# EAGLE schematic Voltage Controlled Amplifier v1 (EAGLE 6.6.0)

## Sheet 1 of 2: Power
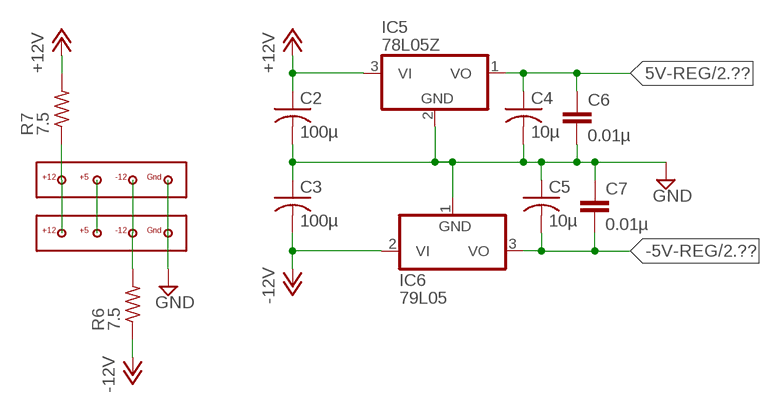
[diagram p0: schematic, sheet 1]

### Parts
C2  100µ  C-US025-050X050  [C025-050X050]
C3  100µ  C-US025-050X050  [C025-050X050]
C4  10µ  C-US025-050X050  [C025-050X050]
C5  10µ  C-US025-050X050  [C025-050X050]
C6  0.01µ  C2.5/2  [C2.5-2]
C7  0.01µ  C2.5/2  [C2.5-2]
IC5  78L05Z  [TO92]
IC6  79L05  79L05Z  [TO92]
R6  7.5  R-US_0204/7  [0204/7]
R7  7.5  R-US_0204/7  [0204/7]
U$3  POWER_CONNECTOR_4_RGBB  [POWER_CONNECTOR_4_RGBB]
U$7  POWER_CONNECTOR_4_RGBB  [POWER_CONNECTOR_4_RGBB]

### Nets
5V-REG: C4.1 C6.1 IC5.1(VO) ; also sheet 2
+12V: C2.1 IC5.3(VI) R7.2 ; also sheet 2
-5V-REG: C5.2 C7.2 IC6.3(VO) ; also sheet 2
-12V: C3.2 IC6.2(VI) R6.1 ; also sheet 2
GND: C2.2 C3.1 C4.2 C5.1 C6.2 C7.1 IC5.2(GND) IC6.1(GND) U$3.GND U$7.GND ; also sheet 2
N$10: R7.1 U$3.+12 U$7.+12
N$11: U$3.+5 U$7.+5
N$12: R6.2 U$3.-12 U$7.-12

## Sheet 2 of 2
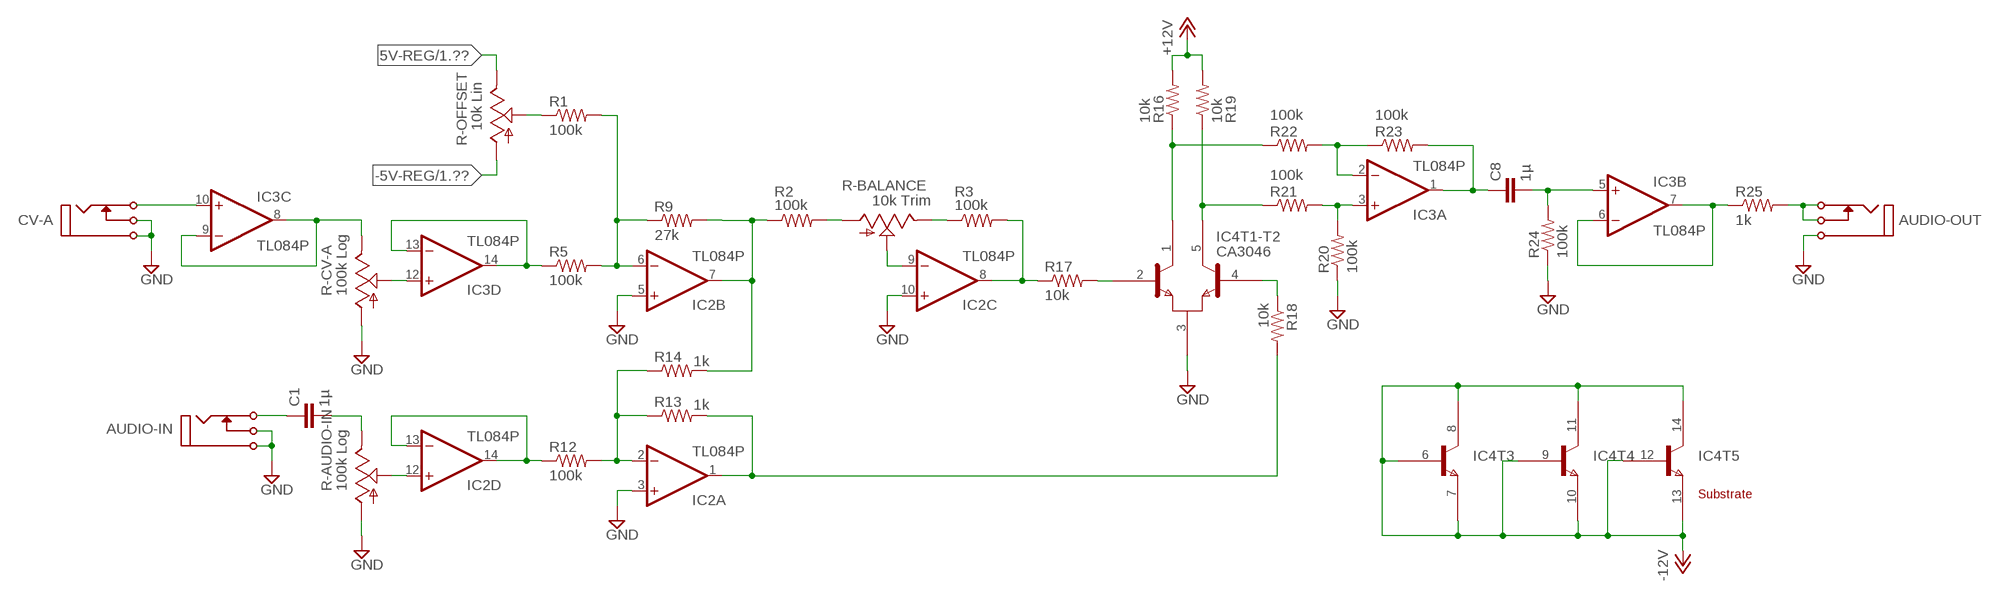
[diagram p1: schematic, sheet 2]

### Parts
AUDIO-IN  I/O  MONO_JACK  [MONO_JACK]
AUDIO-OUT  I/O  MONO_JACK  [MONO_JACK]
C1  1µ  C2.5/2  [C2.5-2]
C8  1µ  C2.5/2  [C2.5-2]
CV-A  I/O  MONO_JACK  [MONO_JACK]
IC2  TL084P  [DIL14]
IC3  TL084P  [DIL14]
IC4  CA3046  [DIL14]
R1  100k  R-US_0204/7  [0204/7]
R2  100k  R-US_0204/7  [0204/7]
R3  100k  R-US_0204/7  [0204/7]
R5  100k  R-US_0204/7  [0204/7]
R9  27k  R-US_0204/7  [0204/7]
R12  100k  R-US_0204/7  [0204/7]
R13  1k  R-US_0204/7  [0204/7]
R14  1k  R-US_0204/7  [0204/7]
R16  10k  R-US_0204/7  [0204/7]
R17  10k  R-US_0204/7  [0204/7]
R18  10k  R-US_0204/7  [0204/7]
R19  10k  R-US_0204/7  [0204/7]
R20  100k  R-US_0204/7  [0204/7]
R21  100k  R-US_0204/7  [0204/7]
R22  100k  R-US_0204/7  [0204/7]
R23  100k  R-US_0204/7  [0204/7]
R24  100k  R-US_0204/7  [0204/7]
R25  1k  R-US_0204/7  [0204/7]
R-AUDIO-IN  100k Log  TRIM_US-B64Y  [B64Y]
R-BALANCE  10k Trim  TRIM_US-B64Y  [B64Y]
R-CV-A  100k Log  TRIM_US-B64Y  [B64Y]
R-OFFSET  10k Lin  TRIM_US-B64Y  [B64Y]

### Nets
5V-REG: R-OFFSET.E ; also sheet 1
+12V: R16.2 R19.2 ; also sheet 1
-5V-REG: R-OFFSET.A ; also sheet 1
-12V: IC4.6(T3:B) IC4.7(T3:E) IC4.8(T3:C) IC4.9(T4:B) IC4.10(T4:E) IC4.11(T4:C) IC4.12(T5:B) IC4.13(T5:E) IC4.14(T5:C) ; also sheet 1
GND: AUDIO-IN.P$1 AUDIO-IN.P$3(P3) AUDIO-OUT.P$1 CV-A.P$1 CV-A.P$3(P3) IC2.3(A:+IN) IC2.5(B:+IN) IC2.10(C:+IN) IC4.3(T1-T2:E) R20.1 R24.1 R-AUDIO-IN.A R-CV-A.A ; also sheet 1
N$1: IC3.13(D:-IN) IC3.14(D:OUT) R5.1
N$2: IC4.2(T1-T2:B1) R17.2
N$3: CV-A.P$2(P2) IC3.10(C:+IN)
N$4: IC3.8(C:OUT) IC3.9(C:-IN) R-CV-A.E
N$5: R3.1 R-BALANCE.E
N$6: IC2.6(B:-IN) R1.2 R5.2 R9.1
N$7: R2.2 R-BALANCE.A
N$13: R1.1 R-OFFSET.S
N$14: IC3.12(D:+IN) R-CV-A.S
N$15: IC2.7(B:OUT) R2.1 R14.2
N$16: R9.2
N$17: AUDIO-IN.P$2(P2) C1.1
N$18: IC2.13(D:-IN) IC2.14(D:OUT) R12.1
N$19: IC2.12(D:+IN) R-AUDIO-IN.S
N$20: C1.2 R-AUDIO-IN.E
N$21: IC4.4(T1-T2:B2) R18.1
N$22: IC2.2(A:-IN) R12.2 R13.1 R14.1
N$23: IC2.8(C:OUT) R3.2 R17.1
N$24: IC4.1(T1-T2:C1) R16.1 R22.1
N$25: IC2.9(C:-IN) R-BALANCE.S
N$26: IC4.5(T1-T2:C2) R19.1 R21.1
N$27: IC2.1(A:OUT) R13.2 R18.2
N$28: IC3.3(A:+IN) R20.2 R21.2
N$29: C8.2 IC3.5(B:+IN) R24.2
N$30: IC3.2(A:-IN) R22.2 R23.1
N$31: C8.1 IC3.1(A:OUT) R23.2
N$32: AUDIO-OUT.P$2(P2) AUDIO-OUT.P$3(P3) R25.2
N$34: IC3.6(B:-IN) IC3.7(B:OUT) R25.1

## Power pins joined to a net without a drawn wire
V+: IC2.4(P:V+) IC3.4(P:V+)
V-: IC2.11(P:V-) IC3.11(P:V-)

## Library data of the parts
AUDIO-IN AUDIO-OUT CV-A = !synth_sch:MONO_JACK
C1 C6-C8 = capacitor-wima:C: CAPACITOR naming: grid - package width
C2-C5 = rcl:C-US: CAPACITOR, American symbol
IC2 IC3 = linear:TL084: OP AMP
IC4 = !synthdiy:CA3046: NPN Transistor Array
IC5 = linear:78*: Positive VOLTAGE REGULATOR Source: http://cache.national.com/ds/LM/LM78L05.pdf http://www.fairchildsemi.com/ds/LM/LM7805.pdf
IC6 = linear:79*: Negative VOLTAGE REGULATOR
R1-R3 R5-R7 R9 R12-R14 R16-R25 = resistor:R-US_: RESISTOR, American symbol
R-AUDIO-IN R-BALANCE R-CV-A R-OFFSET = pot:TRIM_US-: POTENTIOMETER
U$3 U$7 = !synth_sch:POWER_CONNECTOR_4_RGBB